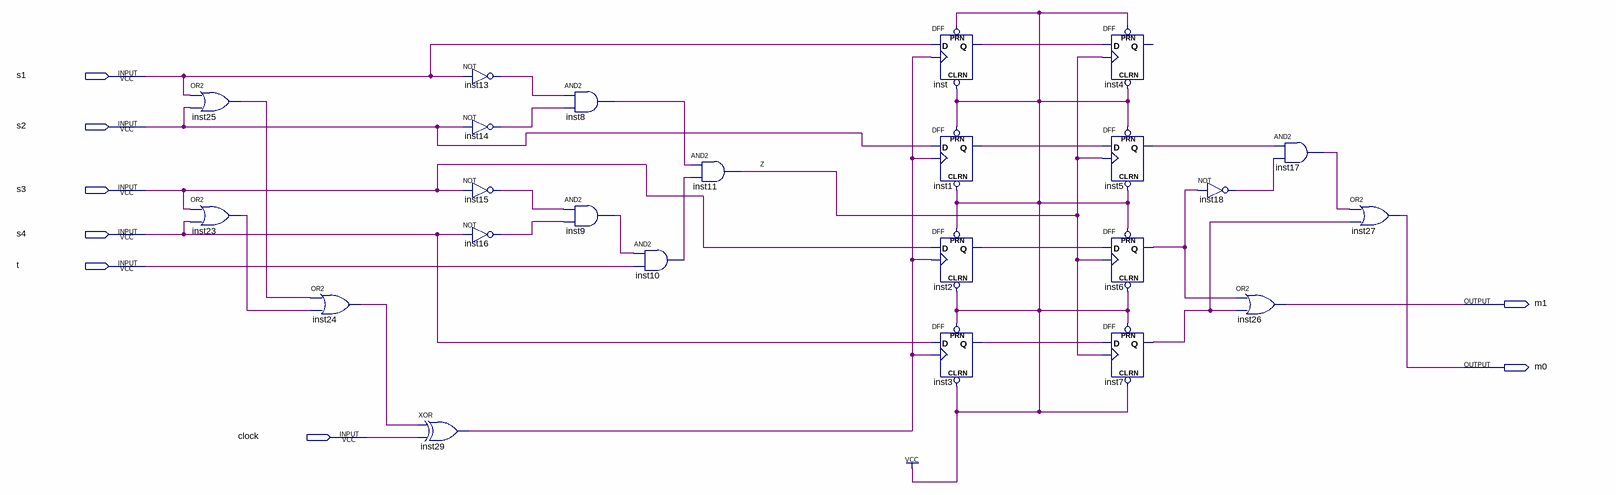
[diagram p0: schematic sheet]
// Quartus schematic Logic_Lab_Project.bdf as structural Verilog: 24 symbols, 8 pins
module Logic_Lab_Project (
  input  s1,
  input  s2,
  input  s3,
  input  s4,
  input  t,
  input  clock,
  output m1,
  output m0
);

  wire inst1_q, inst2_q, inst3_q, inst5_q, inst6_q, inst7_q, inst8_out, inst9_out, inst10_out, inst11_out,
       inst13_out, inst14_out, inst15_out, inst16_out, inst17_out, inst18_out, inst23_out, inst24_out,
       inst25_out, inst29_out, inst_q;

  or inst25 (inst25_out, s1, s2);
  or inst23 (inst23_out, s3, s4);
  or inst24 (inst24_out, inst25_out, inst23_out);
  xor inst29 (inst29_out, inst24_out, clock);
  not inst13 (inst13_out, s1);
  not inst14 (inst14_out, s2);
  not inst15 (inst15_out, s3);
  not inst16 (inst16_out, s4);
  and inst8 (inst8_out, inst13_out, inst14_out);
  and inst9 (inst9_out, inst15_out, inst16_out);
  and inst10 (inst10_out, inst9_out, t);
  and inst11 (inst11_out, inst8_out, inst10_out);
  DFF inst (.CLRN(1'b1), .CLK(inst29_out), .D(s1), .PRN(1'b1), .Q(inst_q));
  DFF inst1 (.CLRN(1'b1), .CLK(inst29_out), .D(s2), .PRN(1'b1), .Q(inst1_q));
  DFF inst2 (.CLRN(1'b1), .CLK(inst29_out), .D(s3), .PRN(1'b1), .Q(inst2_q));
  DFF inst3 (.CLRN(1'b1), .CLK(inst29_out), .D(s4), .PRN(1'b1), .Q(inst3_q));
  DFF inst4 (.CLRN(1'b1), .CLK(inst11_out), .D(inst_q), .PRN(1'b1));  // open: Q
  DFF inst5 (.CLRN(1'b1), .CLK(inst11_out), .D(inst1_q), .PRN(1'b1), .Q(inst5_q));
  DFF inst6 (.CLRN(1'b1), .CLK(inst11_out), .D(inst2_q), .PRN(1'b1), .Q(inst6_q));
  DFF inst7 (.CLRN(1'b1), .CLK(inst11_out), .D(inst3_q), .PRN(1'b1), .Q(inst7_q));
  not inst18 (inst18_out, inst6_q);
  or inst26 (m1, inst6_q, inst7_q);
  and inst17 (inst17_out, inst5_q, inst18_out);
  or inst27 (m0, inst17_out, inst7_q);

  // Notes on the sheet:
  //   z
endmodule
